# EAGLE schematic BOB-001 (EAGLE 9.2.2)

## Sheet 1 of 3
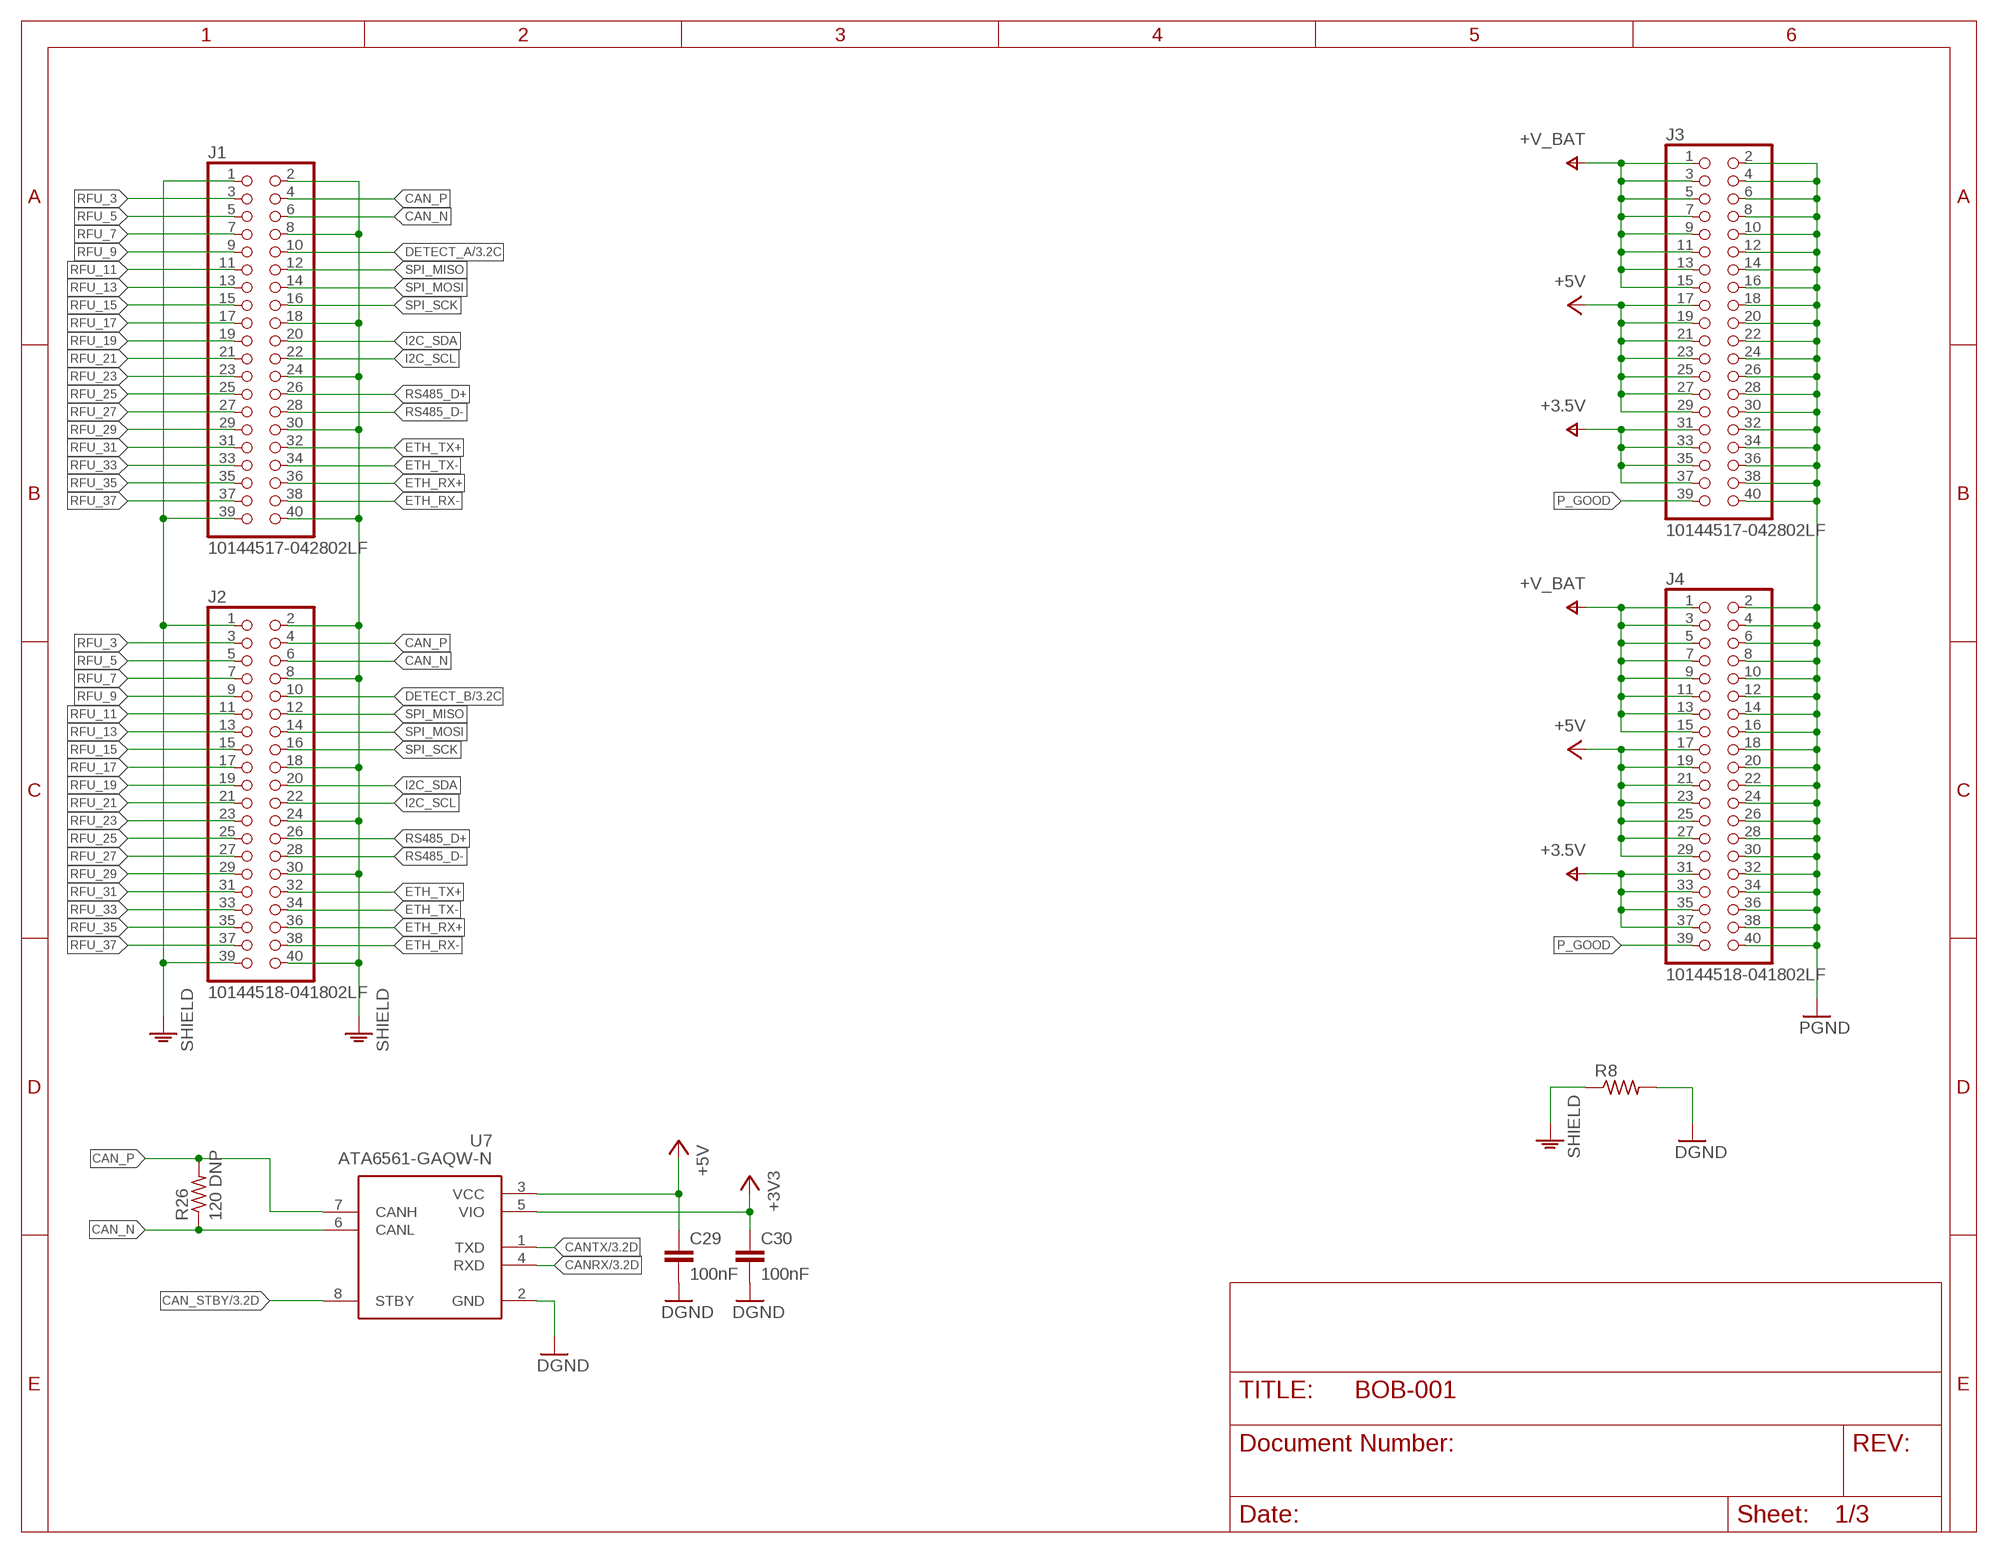
[diagram p0: schematic, sheet 1]

### Parts
C29  100nF  C-EUC0402  [C0402]
C30  100nF  C-EUC0402  [C0402]
J1  10144517-042802LF  [10144517-042802LF]
J2  10144518-041802LF  [10144518-041802LF]
J3  10144517-042802LF  [10144517-042802LF]
J4  10144518-041802LF  [10144518-041802LF]
R8  R-US_R0402  [R0402]
R26  120 DNP  R-US_R0402  [R0402]
U7  ATA6561-GAQW-N  [SOIC127P600X175-8N]

### Nets
+3.5V: J3.31 J3.33 J3.35 J3.37 J4.31 J4.33 J4.35 J4.37 ; also sheet 2
+3V3: C30.1 U7.5(VIO) ; also sheet 2,3
+5V: C29.1 J3.17 J3.19 J3.21 J3.23 J3.25 J3.27 J3.29 J4.17 J4.19 J4.21 J4.23 J4.25 J4.27 J4.29 U7.3(VCC)
+V_BAT: J3.1 J3.3 J3.5 J3.7 J3.9 J3.11 J3.13 J3.15 J4.1 J4.3 J4.5 J4.7 J4.9 J4.11 J4.13 J4.15
CAN_N: J1.6 J2.6 R26.1 U7.6(CANL)
CAN_P: J1.4 J2.4 R26.2 U7.7(CANH)
CAN_STBY: U7.8(STBY) ; also sheet 3
CANRX: U7.4(RXD) ; also sheet 3
CANTX: U7.1(TXD) ; also sheet 3
DETECT_A: J1.10 ; also sheet 3
DETECT_B: J2.10 ; also sheet 3
DGND: C29.2 C30.2 R8.2 U7.2(GND) ; also sheet 2,3
ETH_RX+: J1.36 J2.36
ETH_RX-: J1.38 J2.38
ETH_TX+: J1.32 J2.32
ETH_TX-: J1.34 J2.34
I2C_SCL: J1.22 J2.22
I2C_SDA: J1.20 J2.20
P_GOOD: J3.39 J4.39
PGND: J3.2 J3.4 J3.6 J3.8 J3.10 J3.12 J3.14 J3.16 J3.18 J3.20 J3.22 J3.24 J3.26 J3.28 J3.30 J3.32 J3.34 J3.36 J3.38 J3.40 J4.2 J4.4 J4.6 J4.8 J4.10 J4.12 J4.14 J4.16 J4.18 J4.20 J4.22 J4.24 J4.26 J4.28 J4.30 J4.32 J4.34 J4.36 J4.38 J4.40 ; also sheet 2
RFU_3: J1.3 J2.3
RFU_5: J1.5 J2.5
RFU_7: J1.7 J2.7
RFU_9: J1.9 J2.9
RFU_11: J1.11 J2.11
RFU_13: J1.13 J2.13
RFU_15: J1.15 J2.15
RFU_17: J1.17 J2.17
RFU_19: J1.19 J2.19
RFU_21: J1.21 J2.21
RFU_23: J1.23 J2.23
RFU_25: J1.25 J2.25
RFU_27: J1.27 J2.27
RFU_29: J1.29 J2.29
RFU_31: J1.31 J2.31
RFU_33: J1.33 J2.33
RFU_35: J1.35 J2.35
RFU_37: J1.37 J2.37
RS485_D+: J1.26 J2.26
RS485_D-: J1.28 J2.28
SHIELD: J1.1 J1.2 J1.8 J1.18 J1.24 J1.30 J1.39 J1.40 J2.1 J2.2 J2.8 J2.18 J2.24 J2.30 J2.39 J2.40 R8.1
SPI_MISO: J1.12 J2.12
SPI_MOSI: J1.14 J2.14
SPI_SCK: J1.16 J2.16

## Sheet 2 of 3
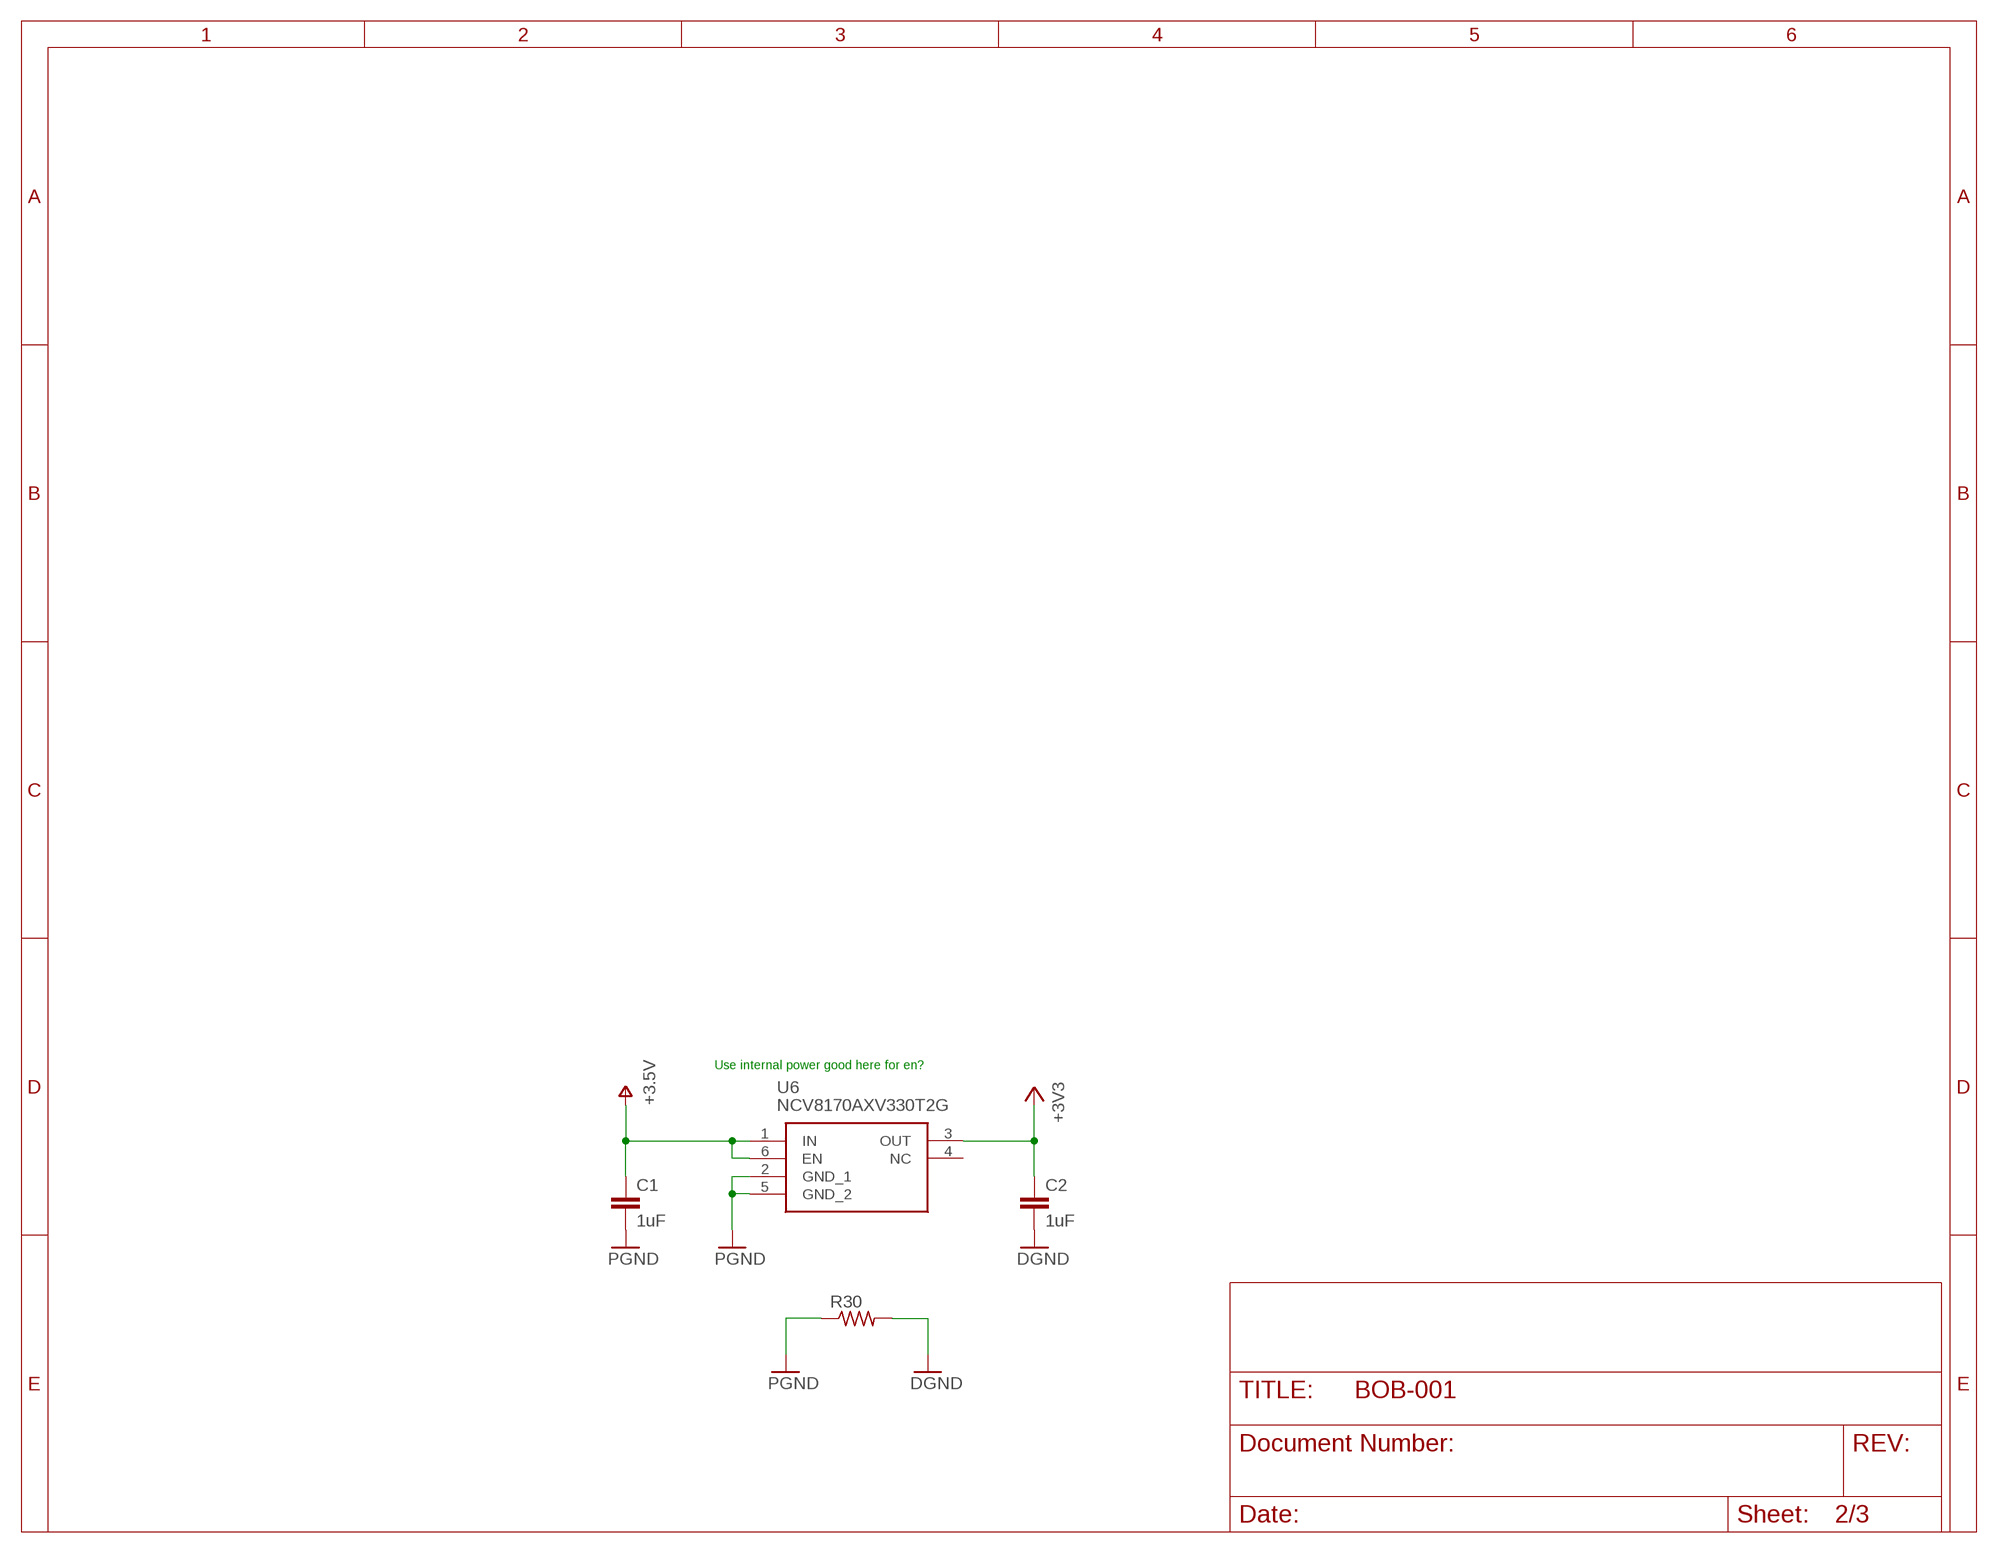
[diagram p1: schematic, sheet 2]

### Parts
C1  1uF  C-EUC0603  [C0603]
C2  1uF  C-EUC0603  [C0603]
R30  R-US_R0402  [R0402]
U6  NCV8170AXV330T2G  [SOTFL50P160X60-6N]

### Nets
+3.5V: C1.1 U6.1(IN) U6.6(EN) ; also sheet 1
+3V3: C2.1 U6.3(OUT) ; also sheet 1,3
DGND: C2.2 R30.2 ; also sheet 1,3
PGND: C1.2 R30.1 U6.2(GND_1) U6.5(GND_2) ; also sheet 1
Unconnected: U6.4(NC)

### Notes on the sheet
- Use internal power good here for en?

## Sheet 3 of 3
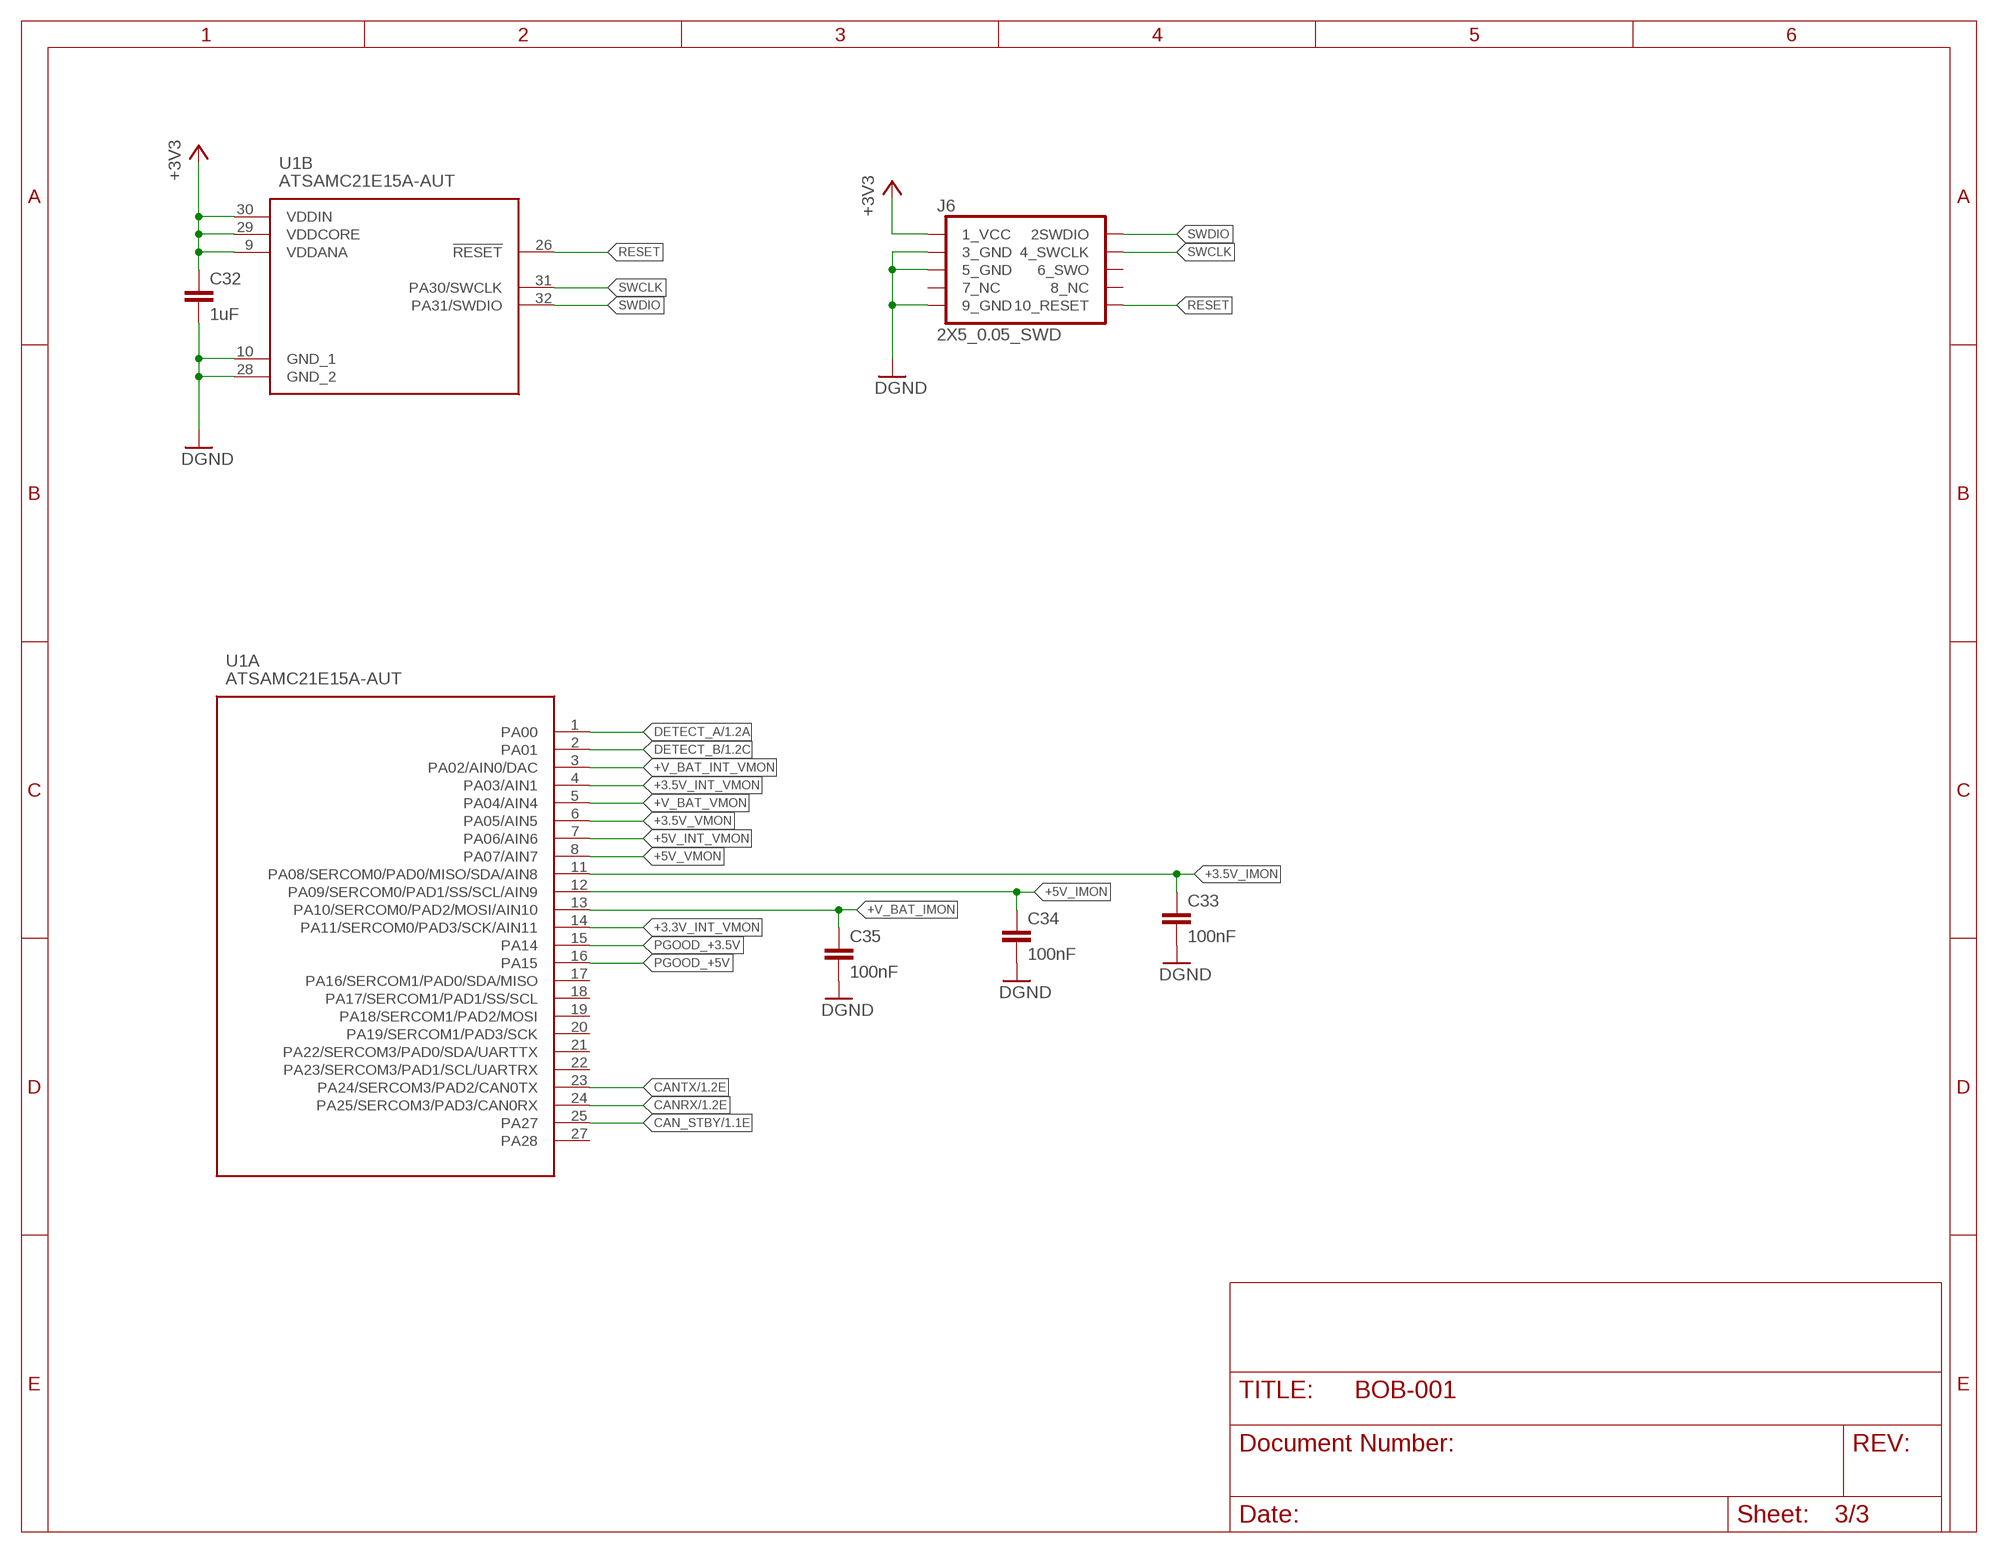
[diagram p2: schematic, sheet 3]

### Parts
C32  1uF  C-EUC0805  [C0805]
C33  100nF  C-EUC0402  [C0402]
C34  100nF  C-EUC0402  [C0402]
C35  100nF  C-EUC0402  [C0402]
J6  2X5_0.05_SWD  [2X5_RIGHT]
U1  ATSAMC21E15A-AUT  [QFP80P900X900X120-32N]

### Nets
+3.3V_INT_VMON: U1.14(A:PA11/SERCOM0/PAD3/SCK/AIN11)
+3.5V_IMON: C33.1 U1.11(A:PA08/SERCOM0/PAD0/MISO/SDA/AIN8)
+3.5V_INT_VMON: U1.4(A:PA03/AIN1)
+3.5V_VMON: U1.6(A:PA05/AIN5)
+3V3: C32.1 J6.1(1_VCC) U1.9(B:VDDANA) U1.29(B:VDDCORE) U1.30(B:VDDIN) ; also sheet 1,2
+5V_IMON: C34.1 U1.12(A:PA09/SERCOM0/PAD1/SS/SCL/AIN9)
+5V_INT_VMON: U1.7(A:PA06/AIN6)
+5V_VMON: U1.8(A:PA07/AIN7)
+V_BAT_IMON: C35.1 U1.13(A:PA10/SERCOM0/PAD2/MOSI/AIN10)
+V_BAT_INT_VMON: U1.3(A:PA02/AIN0/DAC)
+V_BAT_VMON: U1.5(A:PA04/AIN4)
CAN_STBY: U1.25(A:PA27) ; also sheet 1
CANRX: U1.24(A:PA25/SERCOM3/PAD3/CAN0RX) ; also sheet 1
CANTX: U1.23(A:PA24/SERCOM3/PAD2/CAN0TX) ; also sheet 1
DETECT_A: U1.1(A:PA00) ; also sheet 1
DETECT_B: U1.2(A:PA01) ; also sheet 1
DGND: C32.2 C33.2 C34.2 C35.2 J6.3(3_GND) J6.5(5_GND) J6.9(9_GND) U1.10(B:GND_1) U1.28(B:GND_2) ; also sheet 1,2
PGOOD_+3.5V: U1.15(A:PA14)
PGOOD_+5V: U1.16(A:PA15)
RESET: J6.10(10_RESET) U1.26(B:!RESET)
SWCLK: J6.4(4_SWCLK) U1.31(B:PA30/SWCLK)
SWDIO: J6.2(2SWDIO) U1.32(B:PA31/SWDIO)
Unconnected: J6.6(6_SWO) J6.7(7_NC) J6.8(8_NC) U1.17(A:PA16/SERCOM1/PAD0/SDA/MISO) U1.18(A:PA17/SERCOM1/PAD1/SS/SCL) U1.19(A:PA18/SERCOM1/PAD2/MOSI) U1.20(A:PA19/SERCOM1/PAD3/SCK) U1.21(A:PA22/SERCOM3/PAD0/SDA/UARTTX) U1.22(A:PA23/SERCOM3/PAD1/SCL/UARTRX) U1.27(A:PA28)

## Library data of the parts
C1 C2 C29 C30 C32-C35 = rcl:C-EU: CAPACITOR, European symbol; SPICEPREFIX: C
J1 J3 = BergStak:10144517-04
J2 J4 = BergStak:10144518-04
J6 = Headers:2X5_0.05_SWD
R8 R26 R30 = rcl:R-US_: RESISTOR, American symbol; SPICEPREFIX: R
U1 = SamacSys_Parts:ATSAMC21E15A-AUT: MCU 32-bit SAM C21 ARM Cortex M0+ RISC 32KB Flash 3.3V/5V 32-Pin TQFP T/R Source: Datasheet <https://www.arrow.com/en/products/atsamc21e15a-aut/microchip-technology>; DESCRIPTION: MCU 32-bit SAM C21 ARM Cortex M0+ RISC 32KB Flash 3.3V/5V 32-Pin TQFP T/R; HEIGHT: 1.2mm; MANUFACTURER_NAME: Microchip; MANUFACTURER_PART_NUMBER: ATSAMC21E15A-AUT
U6 = SamacSys_Parts:NCV8170AXV330T2G: ON Semiconductor NCV8170AXV330T2G, LDO Voltage Regulator, 3.3 V +/-1%, 2.2 5.5 Vin, 6-Pin SOT-563 Source: Datasheet <https://componentsearchengine.com/Datasheets/1/NCV8170AXV330T2G.pdf>; DESCRIPTION: ON Semiconductor NCV8170AXV330T2G, LDO Voltage Regulator, 3.3 V +/-1%, 2.2 5.5 Vin, 6-Pin SOT-563; HEIGHT: 0.6mm; MANUFACTURER_NAME: ON Semiconductor; MANUFACTURER_PART_NUMBER: NCV8170AXV330T2G; MOUSER_PART_NUMBER: 863-NCV8170AXV330T2G; MOUSER_PRICE-STOCK: https://www.mouser.com/Search/Refine.aspx?Keyword=863-NCV8170AXV330T2G
U7 = SamacSys Managed:ATA6561-GAQW-N: MICROCHIP - ATA6561-GAQW-N - CAN TRANSCEIVER, 5MBPS, -40 TO 150DEG C Source: Datasheet <https://componentsearchengine.com/Datasheets/1/ATA6561-GAQW-N.pdf>; DESCRIPTION: MICROCHIP - ATA6561-GAQW-N - CAN TRANSCEIVER, 5MBPS, -40 TO 150DEG C; HEIGHT: 1.75mm; MANUFACTURER_NAME: Microchip; MANUFACTURER_PART_NUMBER: ATA6561-GAQW-N; MOUSER_PART_NUMBER: 579-ATA6561-GAQW-N; MOUSER_PRICE-STOCK: https://www.mouser.com/Search/Refine.aspx?Keyword=579-ATA6561-GAQW-N